# EAGLE design ser-handsh_01 (EAGLE 7.3.0)
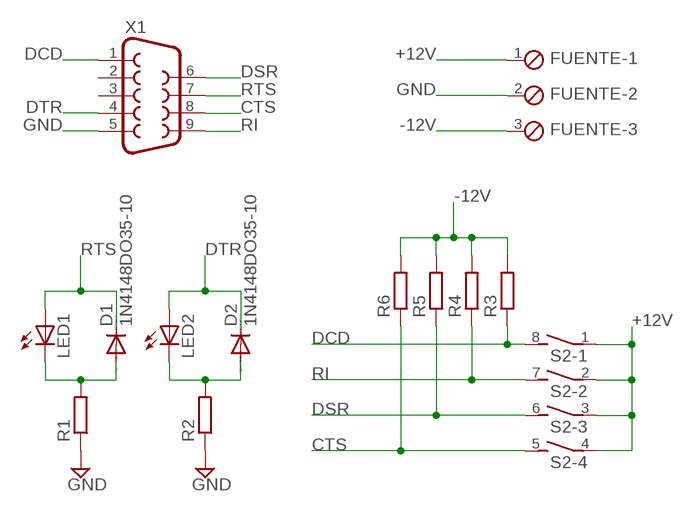
[diagram p0: schematic, sheet 1]

## Parts
D1  1N4148DO35-10  [DO35-10]
D2  1N4148DO35-10  [DO35-10]
FUENTE  MPT3  [3POL254]
LED1  LED5MM  [LED5MM]
LED2  LED5MM  [LED5MM]
R1  R-EU_0207/10  [0207/10]
R2  R-EU_0207/10  [0207/10]
R3  R-EU_0207/10  [0207/10]
R4  R-EU_0207/10  [0207/10]
R5  R-EU_0207/10  [0207/10]
R6  R-EU_0207/10  [0207/10]
S2  DIP04S  [DIP04S]
X1  F09HP  [F09HP]

## Nets
+12V: FUENTE.1 S2.1 S2.2 S2.3 S2.4
-12V: FUENTE.3 R3.2 R4.2 R5.2 R6.2
CTS: R6.1 S2.5 X1.8
DCD: R3.1 S2.8 X1.1
DSR: R5.1 S2.6 X1.6
DTR: D2.C LED2.A X1.4
GND: FUENTE.2 R1.1 R2.1 X1.5
N$2: D1.A LED1.K(C) R1.2
N$4: D2.A LED2.K(C) R2.2
RI: R4.1 S2.7 X1.9
RTS: D1.C LED1.A X1.7
Unconnected: X1.2 X1.3

## Library data of the parts
D1 D2 = diode:1N4148: DIODE high speed (Philips)
FUENTE = con-phoenix-254:MPT3: PHOENIX CONNECTOR; MPN: 444; OC_FARNELL: unknown; OC_NEWARK: unknown
LED1 LED2 = led:LED: LED OSRAM: - CHIPLED LG R971, LG N971, LY N971, LG Q971, LY Q971, LO R971, LY R971 LH N974, LH R974 LS Q976, LO Q976, LY Q976 LO Q996 - Hyper CHIPLED LW Q18S LB Q993, LB Q99A, LB R99A - SideLED LS A670, LO A670, LY A670, LG A670, LP A670 LB A673, LV A673, LT A673, LW A673 LH A674 LY A675 LS A676, LA A676, LO A676, LY A676, LW A676 LS A679, LY A679, LG A679 - Hyper Micro SIDELED® LS Y876, LA Y876, LO Y876, LY Y876 LT Y87S - SmartLED LW L88C, LW L88S LB L89C, LB L89S, LG L890 LS L89K, LO L89K, LY L89K LS L896, LA L896, LO L896, LY L896 - TOPLED LS T670, LO T670, LY T670, LG T670, LP T670 LSG T670, LSP T670, LSY T670, LOP T670, LYG T670 LG T671, LOG T671, LSG T671 LB T673, LV T673, LT T673, LW T673 LH T674 LS T676, LA T676, LO T676, LY T676, LB T676, LH T676, LSB T676, LW T676 LB T67C, LV T67C, LT T67C, LS T67K, LO T67K, LY T67K, LW E67C LS E67B, LA E67B, LO E67B, LY E67B, LB E67C, LV E67C, LT E67C LW T67C LS T679, LY T679, LG T679 LS T770, LO T770, LY T770, LG T770, LP T770 LB T773, LV T773, LT T773, LW T773 LH T774 LS E675, LA E675, LY E675, LS T675 LS T776, LA T776, LO T776, LY T776, LB T776 LHGB T686 LT T68C, LB T68C - Hyper Mini TOPLED® LB M676 - Mini TOPLED Santana® LG M470 LS M47K, LO M47K, LY M47K Source: http://www.osram.convergy.de LUXEON: - LUMILED® LXK2-PW12-R00, LXK2-PW12-S00, LXK2-PW14-U00, LXK2-PW14-V00 LXK2-PM12-R00, LXK2-PM12-S00, LXK2-PM14-U00 LXK2-PE12-Q00, LXK2-PE12-R00, LXK2-PE12-S00, LXK2-PE14-T00, LXK2-PE14-U00 LXK2-PB12-K00, LXK2-PB12-L00, LXK2-PB12-M00, LXK2-PB14-N00, LXK2-PB14-P00, LXK2-PB14-Q00 LXK2-PR12-L00, LXK2-PR12-M00, LXK2-PR14-Q00, LXK2-PR14-R00 LXK2-PD12-Q00, LXK2-PD12-R00, LXK2-PD12-S00 LXK2-PH12-R00, LXK2-PH12-S00 LXK2-PL12-P00, LXK2-PL12-Q00, LXK2-PL12-R00 Source: www.luxeon.com KINGBRIGHT: KA-3528ASYC Source: www.kingbright.com
R1-R6 = rcl:R-EU_: RESISTOR, European symbol
S2 = switch-dil:DIP04S: DIL/CODE SWITCH; OC_FARNELL: unknown; OC_NEWARK: unknown
X1 = con-subd:F09: SUB-D; OC_FARNELL: unknown; OC_NEWARK: unknown

## Board
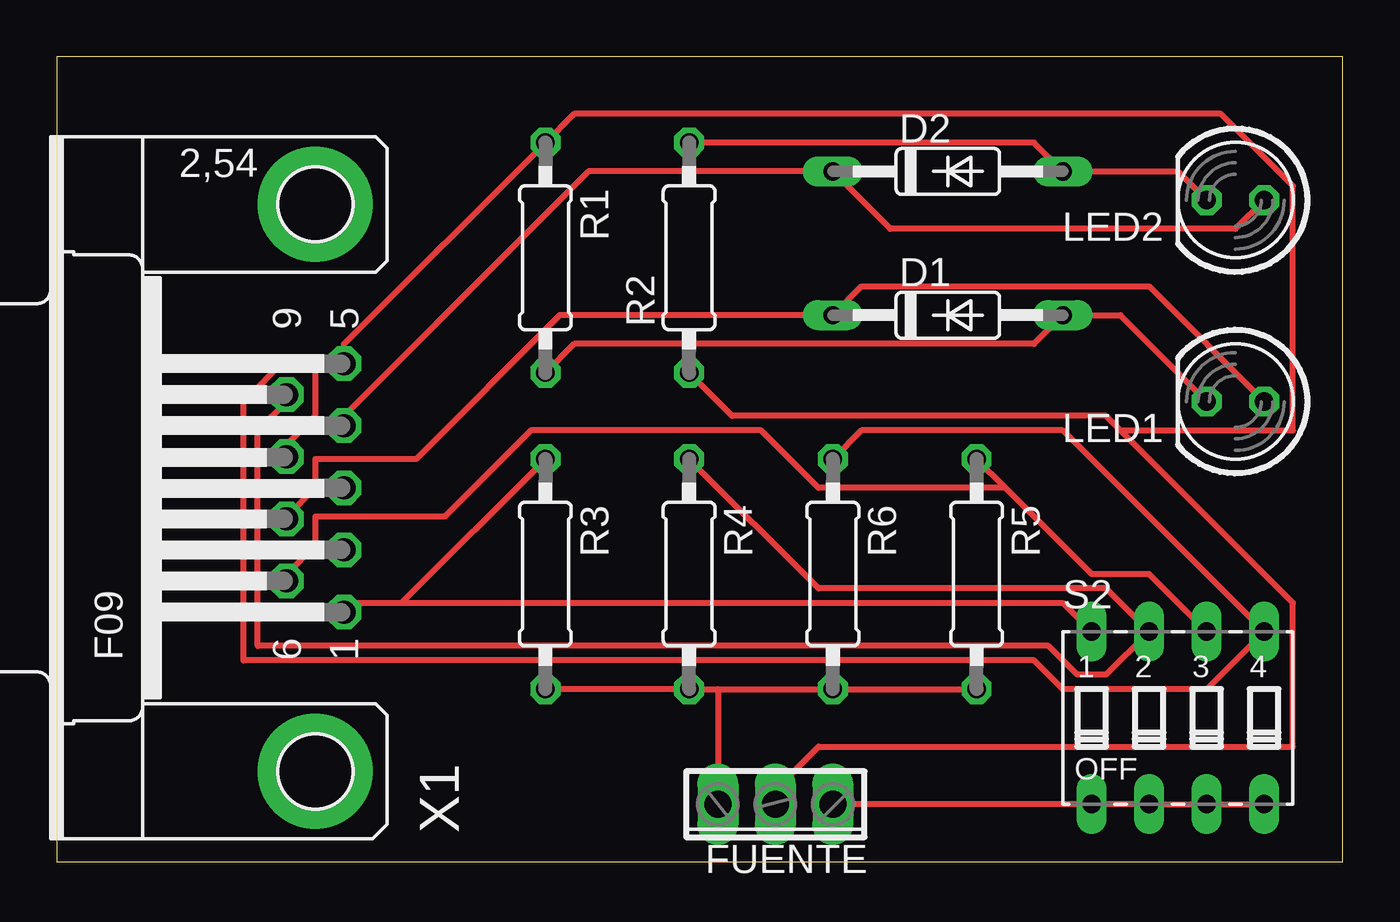
[diagram p1: board, top side]

Size 56.82 x 35.55 mm. Coordinates in mm from the lower left corner, seen from the top.
Outline: 0,0 56.82,0 56.82,35.55 0,35.55 0,0
Copper layers 1: Top 0.035mm
Design rules "default *": minimum track width 10mil, minimum drill 24mil, track to track 8mil, track to pad 8mil, pad to pad 8mil, via to via 8mil, smd to smd 8mil, copper to edge 40mil, drill to drill 8mil, minimum pad ring 10mil, minimum via ring 8mil, stop-mask expansion 4mil, vias tented up to drill 0mil, thermal gap 10mil

### Footprints (pad centres in the part's own frame; a part is rotated, then mirrored left to right if it is on the bottom)
DO35-10 = drill 0.813 long: A 5.08,0; C -5.08,0
3POL254 = drill 1.2 long: 1 -2.54,0; 2 0,0; 3 2.54,0
LED5MM = drill 0.813 octagon: A -1.27,0; K 1.27,0
0207/10 = drill 0.813 octagon: 1 -5.08,0; 2 5.08,0
DIP04S = drill 0.813 long: 1 -3.81,-3.81; 2 -1.27,-3.81; 3 1.27,-3.81; 4 3.81,-3.81; 5 3.81,3.81; 6 1.27,3.81; 7 -1.27,3.81; 8 -3.81,3.81
F09HP = drill 1.016 octagon: 1 -5.486,-1.27; 2 -2.743,-1.27; 3 0,-1.27; 4 2.743,-1.27; 5 5.486,-1.27; 6 -4.115,1.27; 7 -1.372,1.27; 8 1.372,1.27; 9 4.115,1.27 | drill 3.302 pad 5.08: G1 -12.522,0; G2 12.522,0

### Placement (x,y rotation side)
D1  39.37,24.13 0 top
D2  39.37,30.48 0 top
FUENTE  31.75,2.54 180 top
LED1  52.07,20.32 180 top
LED2  52.07,29.21 180 top
R1  21.59,26.67 270 top
R2  27.94,26.67 90 top
R3  21.59,12.7 270 top
R4  27.94,12.7 270 top
R5  40.64,12.7 270 top
R6  34.29,12.7 270 top
S2  49.53,6.35 0 top
X1  11.43,16.51 90 top

### Tracks (layer width: path | path; a pad name or v marks a point on that pad's centre or on a via)
+12V
  Top 0.254: S2.4 S2.3 S2.2 S2.1 FUENTE.1
-12V
  Top 0.254: R3.2 R4.2 29.21,7.62 | 29.21,7.62 R6.2 R5.2 | 29.21,7.62 FUENTE.3
CTS
  Top 0.254: R6.1 35.56,19.05 44.45,19.05 S2.5 50.8,7.62 44.45,7.62 43.18,8.89 8.26,8.89 8.26,20.32 10.16,22.23 11.43,22.23 11.43,19.68 10.16,18.41 X1.8
DCD
  Top 0.254: 15.24,11.43 R3.1 | 15.24,11.43 12.7,11.43 X1.1 | S2.8 44.45,11.43 15.24,11.43
DSR
  Top 0.254: 41.91,16.51 45.72,12.7 48.26,12.7 S2.6 | 41.91,16.51 R5.1 | 41.91,16.51 33.66,16.51 31.11,19.05 20.95,19.05 17.14,15.24 11.43,15.24 11.43,13.97 10.16,12.7 X1.6
DTR
  Top 0.254: LED2.A 52.07,27.94 36.83,27.94 D2.C 23.5,30.48 12.7,19.68 X1.4
GND
  Top 0.254: X1.5 12.7,22.86 R1.1 22.86,33.02 51.44,33.02 54.61,29.84 54.61,19.05 46.99,19.05 | R2.1 29.84,19.68 46.35,19.68 46.99,19.05 | 46.99,19.05 54.61,11.43 54.61,5.08 33.66,5.08 31.75,3.17 FUENTE.2
N$2
  Top 0.254: R1.2 22.86,22.86 43.18,22.86 D1.A 46.99,24.13 LED1.K
N$4
  Top 0.254: R2.2 43.18,31.75 D2.A 49.53,30.48 LED2.K
RI
  Top 0.254: R4.1 33.66,12.06 46.35,12.06 S2.7 46.35,8.26 45.09,8.26 43.81,9.53 8.89,9.53 8.89,19.05 10.16,20.32 X1.9
RTS
  Top 0.254: LED1.A 48.26,25.4 35.56,25.4 D1.C 22.23,24.13 15.88,17.78 11.43,17.78 11.43,16.51 10.16,15.24 X1.7